# EAGLE design darwin-bp4 (EAGLE 9.6.1)
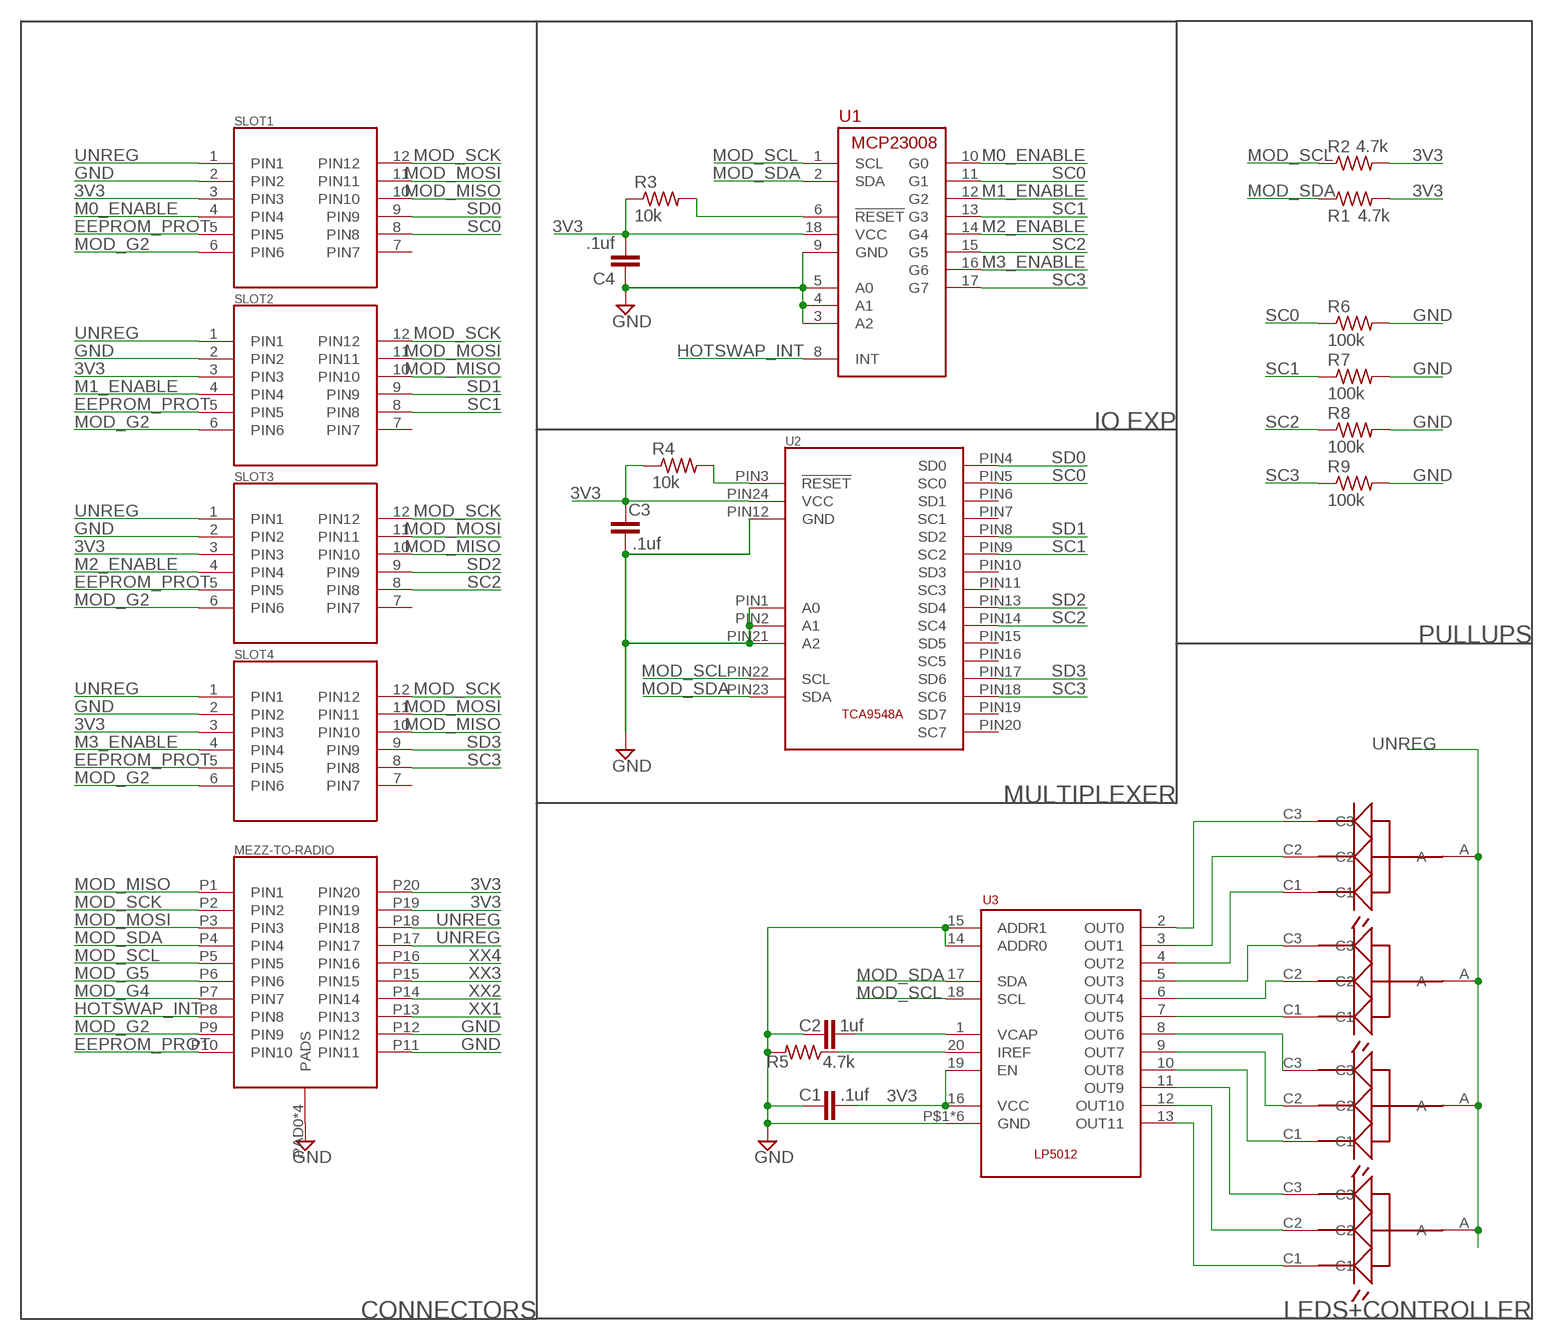
[diagram p0: schematic, sheet 1]

## Parts
C1  .1uf  C-EUC0603K  [C0603K]
C2  1uf  C-EUC0603K  [C0603K]
C3  .1uf  C-EUC0603K  [C0603K]
C4  .1uf  C-EUC0603K  [C0603K]
MEZZ-TO-RADIO  M55-6102042R7102(M)  [M55-7102042R]
R1  4.7k  R-US_R0603  [R0603]
R2  4.7k  R-US_R0603  [R0603]
R3  10k  R-US_R0603  [R0603]
R4  10k  R-US_R0603  [R0603]
R5  4.7k  R-US_R0603  [R0603]
R6  100k  R-US_R0603  [R0603]
R7  100k  R-US_R0603  [R0603]
R8  100k  R-US_R0603  [R0603]
R9  100k  R-US_R0603  [R0603]
SLOT1  2X6-HEADERSDS  [12PH]
SLOT2  2X6-HEADERSDS  [12PH]
SLOT3  2X6-HEADERSDS  [12PH]
SLOT4  2X6-HEADERSDS  [12PH]
U1  MCP23008  [SOIC18-W]
U2  TCA9548A  [TSSOP-24]
U3  LP5012  [QFN40P300X300X80-20N]
U$1  CLMVC-FKC-CGJJM569ABB7A343  [2MMPLCC4]
U$2  CLMVC-FKC-CGJJM569ABB7A343  [2MMPLCC4]
U$3  CLMVC-FKC-CGJJM569ABB7A343  [2MMPLCC4]
U$4  CLMVC-FKC-CGJJM569ABB7A343  [2MMPLCC4]

## Nets
3V3: C1.2 C3.2 C4.2 MEZZ-TO-RADIO.P19(PIN19) MEZZ-TO-RADIO.P20(PIN20) R1.2 R2.2 R3.1 R4.1 SLOT1.3(PIN3) SLOT2.3(PIN3) SLOT3.3(PIN3) SLOT4.3(PIN3) U1.18(VCC) U2.PIN24(VCC) U3.16(VCC) U3.19(EN)
!RESET: R3.2 U1.6(!RESET)
EEPROM_PROT: MEZZ-TO-RADIO.P10(PIN10) SLOT1.5(PIN5) SLOT2.5(PIN5) SLOT3.5(PIN5) SLOT4.5(PIN5)
GND: C1.1 C2.1 C3.1 C4.1 MEZZ-TO-RADIO.P11(PIN11) MEZZ-TO-RADIO.P12(PIN12) MEZZ-TO-RADIO.PAD0(PADS) MEZZ-TO-RADIO.PAD1(PADS) MEZZ-TO-RADIO.PAD2(PADS) MEZZ-TO-RADIO.PAD3(PADS) R5.2 R6.2 R7.2 R8.2 R9.2 SLOT1.2(PIN2) SLOT2.2(PIN2) SLOT3.2(PIN2) SLOT4.2(PIN2) U1.3(A2) U1.4(A1) U1.5(A0) U1.9(GND) U2.PIN1(A0) U2.PIN2(A1) U2.PIN12(GND) U2.PIN21(A2) U3.14(ADDR0) U3.15(ADDR1) U3.P$1(GND) U3.P$2(GND) U3.P$3(GND) U3.P$4(GND) U3.P$5(GND) U3.P$6(GND)
HOTSWAP_INT: MEZZ-TO-RADIO.P8(PIN8) U1.8(INT)
M0_ENABLE: SLOT1.4(PIN4) U1.10(G0)
M1_ENABLE: SLOT2.4(PIN4) U1.12(G2)
M2_ENABLE: SLOT3.4(PIN4) U1.14(G4)
M3_ENABLE: SLOT4.4(PIN4) U1.16(G6)
MOD_G2: MEZZ-TO-RADIO.P9(PIN9) SLOT1.6(PIN6) SLOT2.6(PIN6) SLOT3.6(PIN6) SLOT4.6(PIN6)
MOD_G4: MEZZ-TO-RADIO.P7(PIN7)
MOD_G5: MEZZ-TO-RADIO.P6(PIN6)
MOD_MISO: MEZZ-TO-RADIO.P1(PIN1) SLOT1.10(PIN10) SLOT2.10(PIN10) SLOT3.10(PIN10) SLOT4.10(PIN10)
MOD_MOSI: MEZZ-TO-RADIO.P3(PIN3) SLOT1.11(PIN11) SLOT2.11(PIN11) SLOT3.11(PIN11) SLOT4.11(PIN11)
MOD_SCK: MEZZ-TO-RADIO.P2(PIN2) SLOT1.12(PIN12) SLOT2.12(PIN12) SLOT3.12(PIN12) SLOT4.12(PIN12)
MOD_SCL: MEZZ-TO-RADIO.P5(PIN5) R2.1 U1.1(SCL) U2.PIN22(SCL) U3.18(SCL)
MOD_SDA: MEZZ-TO-RADIO.P4(PIN4) R1.1 U1.2(SDA) U2.PIN23(SDA) U3.17(SDA)
N$1: U3.2(OUT0) U$1.C3
N$2: R4.2 U2.PIN3(!RESET)
N$3: U3.3(OUT1) U$1.C2
N$4: U3.4(OUT2) U$1.C1
N$5: U3.5(OUT3) U$2.C3
N$6: U3.6(OUT4) U$2.C2
N$7: U3.7(OUT5) U$2.C1
N$8: U3.8(OUT6) U$3.C3
N$9: U3.9(OUT7) U$3.C2
N$11: U3.10(OUT8) U$3.C1
N$12: U3.11(OUT9) U$4.C3
N$13: U3.12(OUT10) U$4.C2
N$14: U3.13(OUT11) U$4.C1
N$20: C2.2 U3.1(VCAP)
N$21: R5.1 U3.20(IREF)
SC0: R6.1 SLOT1.8(PIN8) U1.11(G1) U2.PIN5(SC0)
SC1: R7.1 SLOT2.8(PIN8) U1.13(G3) U2.PIN9(SC2)
SC2: R8.1 SLOT3.8(PIN8) U1.15(G5) U2.PIN14(SC4)
SC3: R9.1 SLOT4.8(PIN8) U1.17(G7) U2.PIN18(SC6)
SD0: SLOT1.9(PIN9) U2.PIN4(SD0)
SD1: SLOT2.9(PIN9) U2.PIN8(SD2)
SD2: SLOT3.9(PIN9) U2.PIN13(SD4)
SD3: SLOT4.9(PIN9) U2.PIN17(SD6)
UNREG: MEZZ-TO-RADIO.P17(PIN17) MEZZ-TO-RADIO.P18(PIN18) SLOT1.1(PIN1) SLOT2.1(PIN1) SLOT3.1(PIN1) SLOT4.1(PIN1) U$1.A U$2.A U$3.A U$4.A
XX1: MEZZ-TO-RADIO.P13(PIN13)
XX2: MEZZ-TO-RADIO.P14(PIN14)
XX3: MEZZ-TO-RADIO.P15(PIN15)
XX4: MEZZ-TO-RADIO.P16(PIN16)
Unconnected: SLOT1.7(PIN7) SLOT2.7(PIN7) SLOT3.7(PIN7) SLOT4.7(PIN7) U2.PIN6(SD1) U2.PIN7(SC1) U2.PIN10(SD3) U2.PIN11(SC3) U2.PIN15(SD5) U2.PIN16(SC5) U2.PIN19(SD7) U2.PIN20(SC7)

## Notes on the sheet
- IO EXP
- PULLUPS
- MULTIPLEXER
- CONNECTORS | LEDS+CONTROLLER

## Library data of the parts
C1-C4 = rcl:C-EU: CAPACITOR, European symbol; SPICEPREFIX: C
MEZZ-TO-RADIO = Conservify:M55-6102042R
R1-R9 = rcl:R-US_: RESISTOR, American symbol; SPICEPREFIX: R
SLOT1-SLOT4 = Conservify:2X6-HEADERS
U1 = Conservify:MCP23008
U2 = Conservify:TCA9548A
U3 = Conservify:LP5012
U$1-U$4 = Conservify:CLMVC-FKC-CGJJM569ABB7A343

## Board
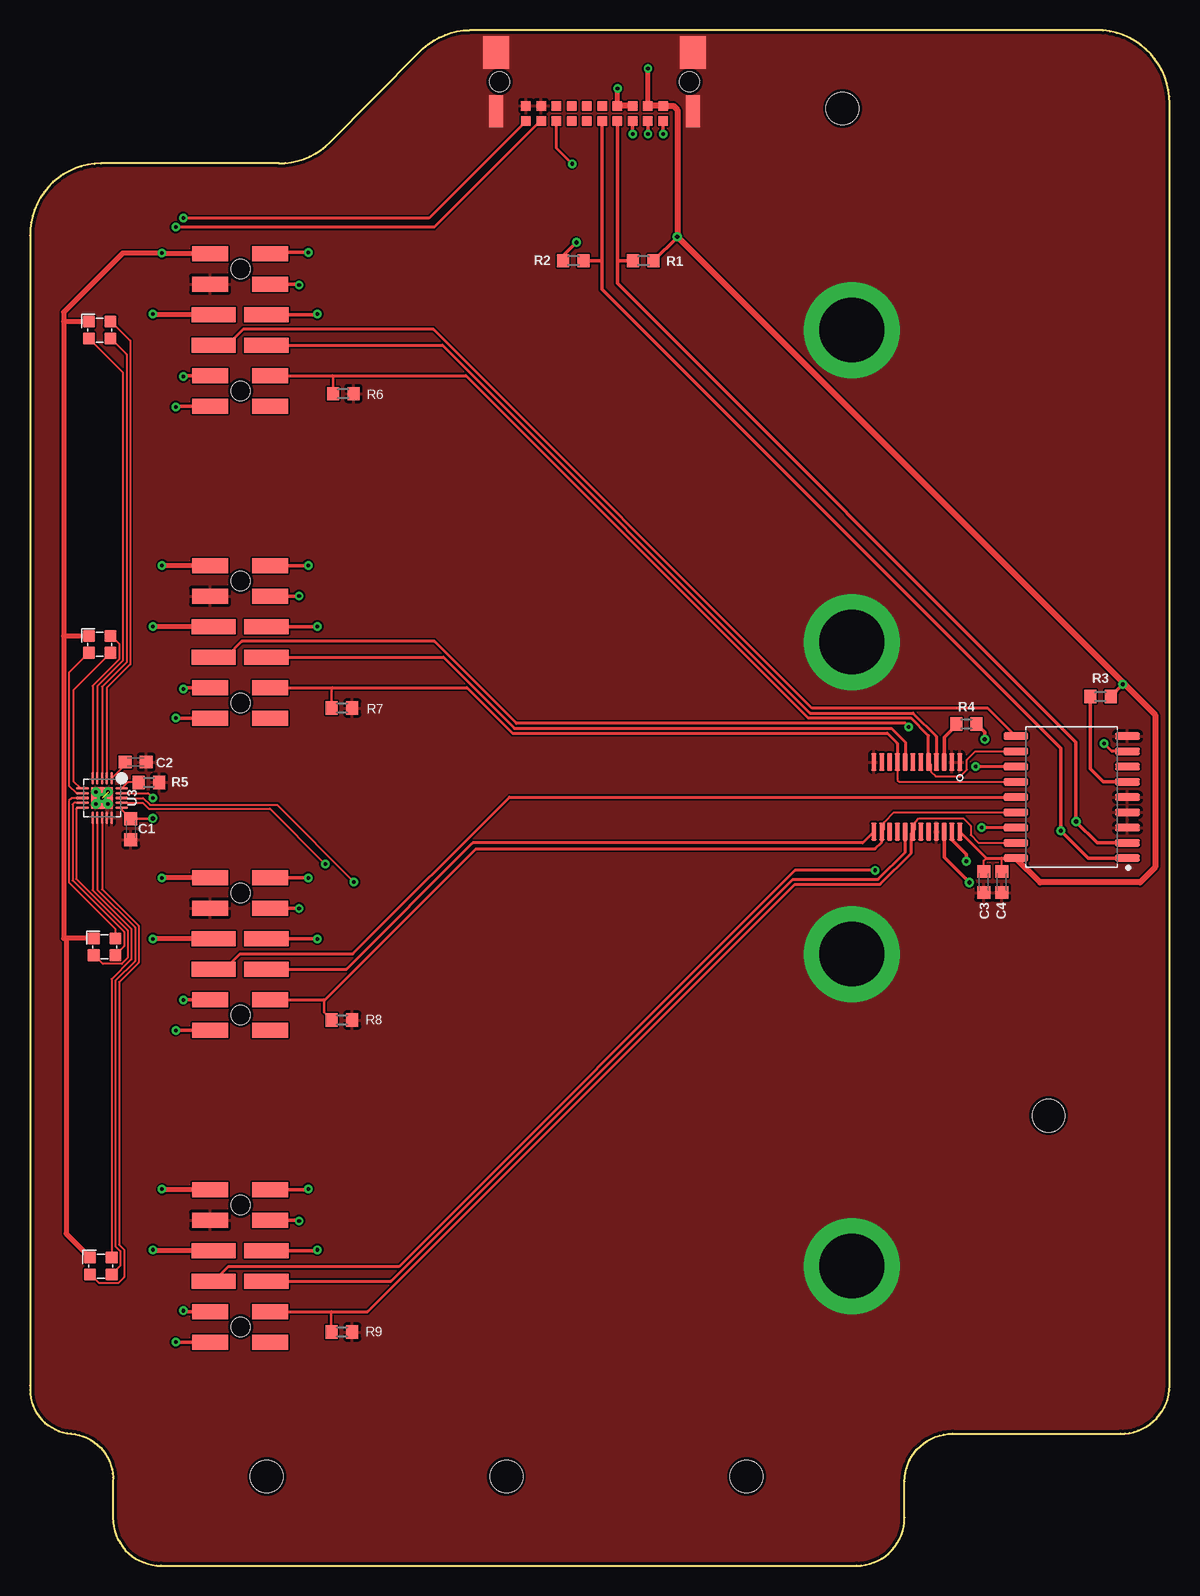
[diagram p1: board, top side]
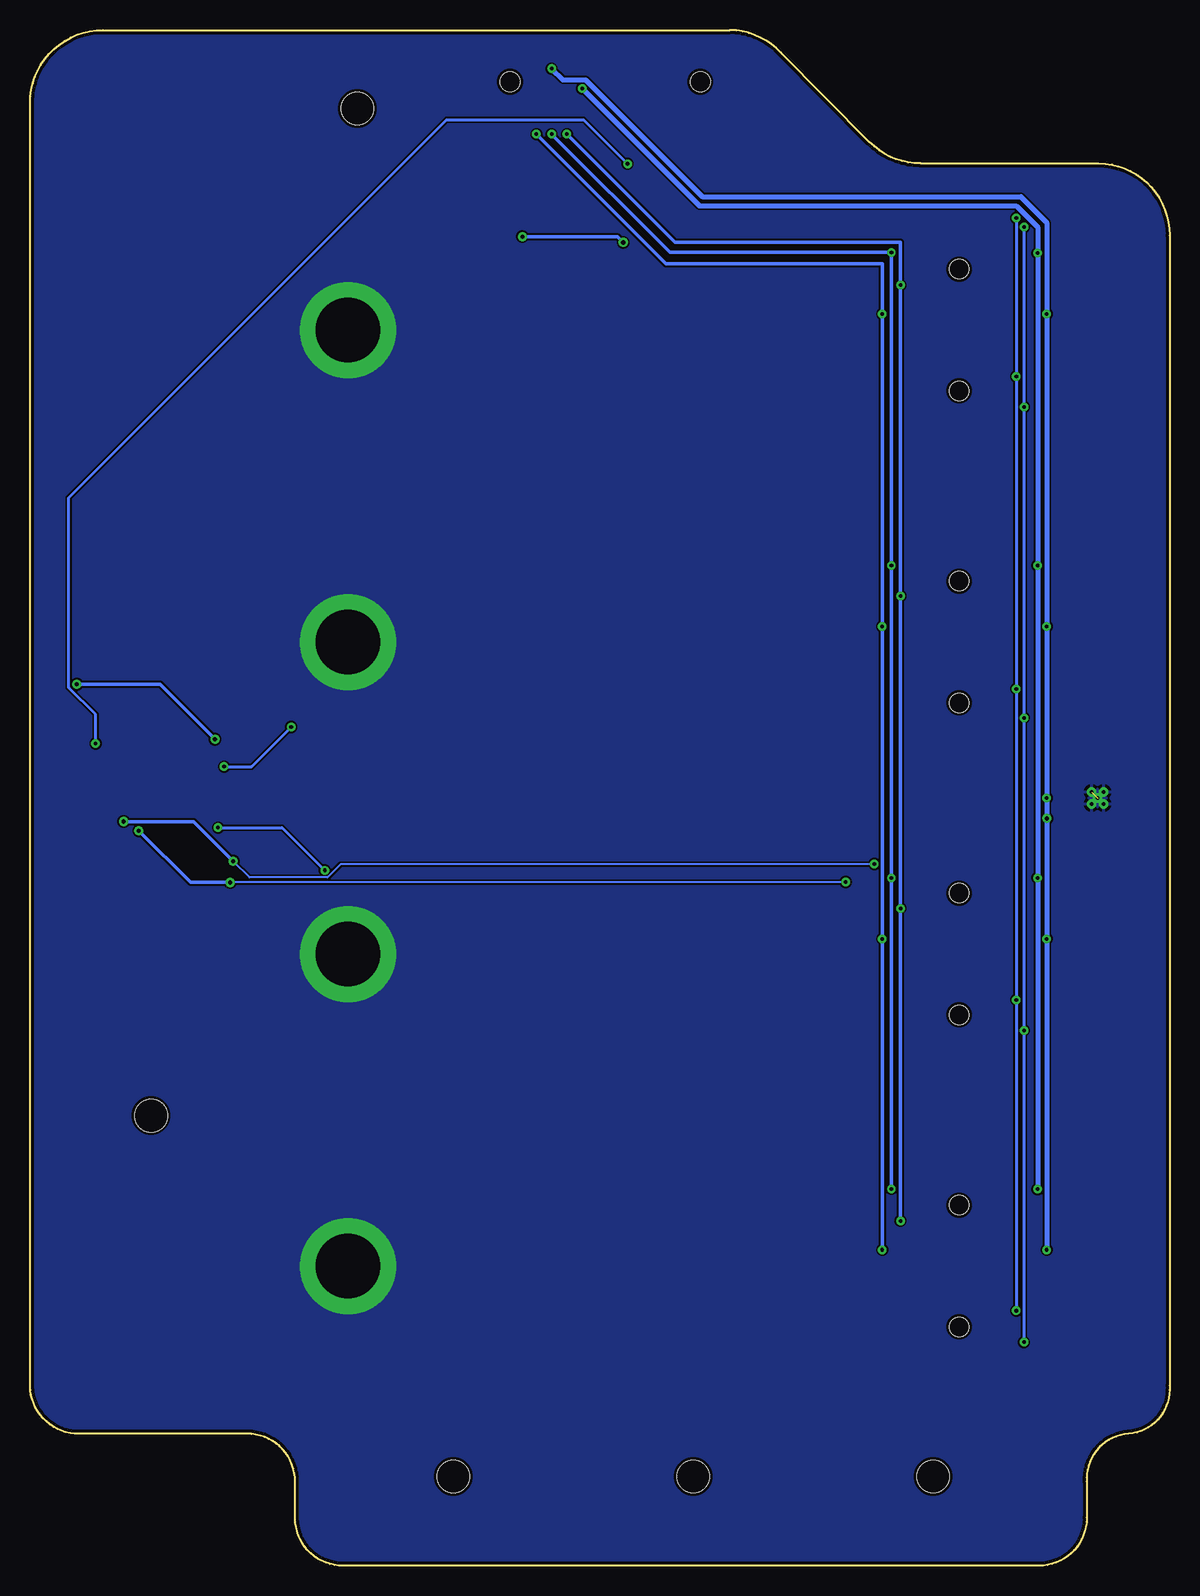
[diagram p2: board, bottom side, seen from below]

Size 95.01 x 127.98 mm. Coordinates in mm from the lower left corner, seen from the top.
Outline: 20.76,116.86 5.91,116.86 arc90 0.01,110.86 0.01,15 arc90 3.41,11 arc-90 6.91,7 6.91,4 arc90 10.91,0 68.91,0 arc90 72.91,4 72.91,7 arc-90 76.91,11 90.91,11 arc90 95.01,15 95.01,121.86 arc90 88.91,127.98 36.66,127.98 arc45 32.4,126.08 25.02,118.64 arc-45 20.76,116.86
Copper layers (1+2*15+16): Top 0.035mm / dielectric 1.5mm / PWR 0.035mm / dielectric 0.15mm / GND 0.035mm / dielectric 0.2mm / Bottom 0.035mm
Design rules "default *": minimum track width 6mil, minimum drill 0.3mm, track to track 6mil, track to pad 6mil, pad to pad 6mil, via to via 6mil, smd to smd 6mil, copper to edge 10mil, drill to drill 6mil, minimum pad ring 10mil, minimum via ring 8mil, stop-mask expansion 4mil, vias tented up to drill 0.31mm, thermal gap 10mil
Holes 2.7 mm at 19.73,7.45 39.73,7.45 59.73,7.45 84.91,37.5 67.73,121.45

### Footprints (pad centres in the part's own frame; a part is rotated, then mirrored left to right if it is on the bottom)
C0603K = smd 1.05 x 1.08: 1 -0.875,0; 2 0.875,0
M55-7102042R = smd 0.8 x 0.8: P1 -5.715,3.27; P2 -4.445,3.27; P3 -3.175,3.27; P4 -1.905,3.27; P5 -0.635,3.27; P6 0.635,3.27; P7 1.905,3.27; P8 3.175,3.27; P9 4.445,3.27; P10 5.715,3.27; P11 5.715,2; P12 4.445,2; P13 3.175,2; P14 1.905,2; P15 0.635,2; P16 -0.635,2; P17 -1.905,2; P18 -3.175,2; P19 -4.445,2; P20 -5.715,2 | smd 2.2 x 2.7: PAD0 -8.21,-2.45; PAD1 8.21,-2.45 | smd 1.2 x 2.7: PAD2 8.21,2.45; PAD3 -8.21,2.45 | hole 1.65: -7.925,0; 7.925,0
R0603 = smd 1 x 1.1: 1 -0.85,0; 2 0.85,0
12PH = smd 3 x 1.27: 1 -2.5,6.35; 2 -2.5,3.81; 5 -2.5,-3.81; 6 -2.5,-6.35; 7 2.5,-6.35; 8 2.5,-3.81; 11 2.5,3.81; 12 2.5,6.35 | smd 3.68 x 1.27: 3 -2.2,1.27; 4 -2.2,-1.27; 9 2.2,-1.27; 10 2.2,1.27 | hole 1.58: 0.041,5.08; 0.041,-5.08
SOIC18-W = smd 2.052 x 0.602: 1 -4.654,5.08; 2 -4.654,3.81; 3 -4.654,2.54; 4 -4.654,1.27; 5 -4.654,0; 6 -4.654,-1.27; 7 -4.654,-2.54; 8 -4.654,-3.81; 9 -4.654,-5.08; 10 4.654,-5.08; 11 4.654,-3.81; 12 4.654,-2.54; 13 4.654,-1.27; 14 4.654,0; 15 4.654,1.27; 16 4.654,2.54; 17 4.654,3.81; 18 4.654,5.08
TSSOP-24 = smd 1.5 x 0.45: PIN1 -3,3; PIN2 -3,2.35; PIN3 -3,1.7; PIN4 -3,1.05; PIN5 -3,0.4; PIN6 -3,-0.25; PIN7 -3,-0.9; PIN8 -3,-1.55; PIN9 -3,-2.2; PIN10 -3,-2.85; PIN11 -3,-3.5; PIN12 -3,-4.15; PIN13 2.8,-4.15; PIN14 2.8,-3.5; PIN15 2.8,-2.85; PIN16 2.8,-2.2; PIN17 2.8,-1.55; PIN18 2.8,-0.9; PIN19 2.8,-0.25; PIN20 2.8,0.4; PIN21 2.8,1.05; PIN22 2.8,1.7; PIN23 2.8,2.35; PIN24 2.8,3
QFN40P300X300X80-20N = smd 1.06 x 0.22: 1 -1.635,0.8; 2 -1.635,0.4; 3 -1.635,0; 4 -1.635,-0.4; 5 -1.635,-0.8; 11 1.635,-0.8; 12 1.635,-0.4; 13 1.635,0; 14 1.635,0.4; 15 1.635,0.8 | smd 0.22 x 1.06: 6 -0.8,-1.635; 7 -0.4,-1.635; 8 0,-1.635; 9 0.4,-1.635; 10 0.8,-1.635; 16 0.8,1.635; 17 0.4,1.635; 18 0,1.635; 19 -0.4,1.635; 20 -0.8,1.635 | smd 1.8 x 1.8: P$1 0,0 | drill 0.3 pad 0.31: P$2 -0.5,0.5; P$3 0.5,0.5; P$4 0.5,-0.5; P$5 -0.5,-0.5; P$6 0,0
2MMPLCC4 = smd 1 x 1: A 0.9,-0.7; C1 0.9,0.7; C2 -0.9,0.7; C3 -0.9,-0.7

### Placement (x,y rotation side)
C1  8.41,61.38 90 top
C2  8.81,66.98 180 top
C3  79.51,56.98 90 top
C4  81.01,56.98 90 top
MEZZ-TO-RADIO  47.06,123.66 180 top
R1  51.14,108.75 0 top
R2  45.3,108.75 180 top
R3  89.24,72.43 180 top
R4  78.06,70.15 180 top
R5  9.91,65.28 0 top
R6  26.11,97.68 0 top
R7  26.01,71.48 0 top
R8  26.01,45.48 0 top
R9  26.01,19.48 0 top
SLOT1  17.51,102.98 0 top
SLOT2  17.51,76.98 0 top
SLOT3  17.51,50.98 0 top
SLOT4  17.51,24.98 0 top
U1  86.84,64.05 180 top
U2  74.51,63.98 270 top
U3  6.01,63.98 270 top
U$1  5.81,102.98 180 top
U$2  5.81,76.78 180 top
U$3  6.21,51.58 180 top
U$4  5.91,24.98 180 top

### Tracks (layer width: path | path; a pad name or v marks a point on that pad's centre or on a via)
3V3  (via drill 0.3, 0.35)
  Top 0.152: U3.16 7.65,63.02 C1.2 | U3.19 9.85,64.38 v10.25,63.98 | C3.2 79.51,58.76 79.72,58.97 | C4.2 81.01,58.97 | 10.22,62.25 v10.25,62.28
  Top 0.203: C1.2 10.22,62.25
  Top 0.254: U2.PIN24 79.72,58.97 81.01,58.97 U1.18
  Top 0.305: R3.1 v91.11,73.45 91.27,73.45 | R4.1 79.59,69.47 v79.59,68.88 | R1.2 53.96,110.72 v53.96,110.76 | R2.2 44.45,109.17 v45.55,110.28
  Top 0.406: MEZZ-TO-RADIO.P19 51.51,124.74 v51.52,124.76 | SLOT1.3 10.31,104.25 v10.25,104.31 | SLOT2.3 10.27,78.25 v10.25,78.27 | SLOT3.3 10.25,52.25 v10.25,52.24 | SLOT4.3 10.33,26.25 v10.25,26.33
  Top 0.508: U1.18 84.22,56.94 92.54,56.94 93.81,58.21 93.81,70.91 91.27,73.45 v53.96,110.76 53.96,121.33 53.63,121.66 MEZZ-TO-RADIO.P20 MEZZ-TO-RADIO.P19
  Bottom 0.305: v45.55,110.28 46.03,110.76 v53.96,110.76 | v79.59,68.88 84.16,73.45 v91.11,73.45
  Bottom 0.406: v51.52,124.76 50.58,123.81 48.69,123.81 38.96,114.09 12.4,114.09 10.25,111.93 v10.25,104.31 v10.25,78.27 v10.25,63.98 v10.25,62.28 v10.25,52.24 v10.25,26.33
!RESET
  Top 0.305: U1.6 89.5,65.32 89.49,65.32 88.39,66.42 R3.2
EEPROM_PROT  (via drill 0.3)
  Top 0.254: MEZZ-TO-RADIO.P10 33.27,112.31 v12.79,112.31
  Top 0.305: SLOT1.5 12.85,99.17 v12.79,99.1 | SLOT2.5 12.89,73.17 v12.79,73.07 | SLOT3.5 12.79,47.17 v12.79,47.16 | SLOT4.5 12.87,21.17 v12.79,21.25
  Bottom 0.254: v12.79,112.31 v12.79,99.1 v12.79,73.07 v12.79,47.16 v12.79,21.25
GND  (via drill 5.4 pad 8)  (1 unrouted)
  other vias: 68.51,102.98 68.51,76.98 68.51,50.98 68.51,24.98
  pour Bottom: 0.01,127.98 95.01,127.98 95.01,-0.02 0.01,-0.02
  pour Top: 0.01,127.98 95.01,127.98 95.01,-0.02 0.01,-0.02
HOTSWAP_INT  (via drill 0.3)
  Top 0.254: U1.8 90.2,67.86 v89.54,68.52 | v45.2,116.83 43.89,118.14 MEZZ-TO-RADIO.P8
  Bottom 0.254: v89.54,68.52 89.54,70.96 91.76,73.18 91.76,89.01 60.28,120.49 48.85,120.49 v45.2,116.83
M0_ENABLE
  Top 0.254: U1.10 79.85,71.47 65.19,71.47 33.64,103.02 17.76,103.02 16.44,101.71 SLOT1.4
M1_ENABLE  (via drill 0.3)
  Top 0.254: U1.12 v78.83,66.59 | v73.24,69.89 73.24,69.96 73,70.2 40.55,70.2 33.73,77.02 17.66,77.02 16.34,75.71 SLOT2.4
  Bottom 0.254: v78.83,66.59 76.54,66.59 v73.24,69.89
M2_ENABLE
  Top 0.254: SLOT3.4 16.22,49.71 17.51,51 26.91,51 39.97,64.05 U1.14
M3_ENABLE  (via drill 0.3)
  Top 0.254: U1.16 v79.34,61.51 v79.33,61.51 | v70.44,57.95 63.77,57.95 30.75,24.93 16.54,24.93 SLOT4.4
  Bottom 0.254: v79.33,61.51 74,61.51 v70.44,57.95
MOD_G2  (via drill 0.3)
  Top 0.254: MEZZ-TO-RADIO.P9 42.54,120.39 33.7,111.55 v12.15,111.55
  Top 0.305: SLOT1.6 12.22,96.63 v12.15,96.56 | SLOT2.6 12.18,70.63 v12.15,70.65 | SLOT3.6 v12.16,44.63 v12.15,44.62 | SLOT4.6 v12.16,18.63 v12.15,18.64
  Bottom 0.254: v12.15,111.55 v12.15,96.56 v12.15,70.65 v12.15,44.62 v12.15,18.64
MOD_MISO  (via drill 0.3)
  Top 0.305: MEZZ-TO-RADIO.P1 52.78,119.31 v52.79,119.29 | SLOT1.10 23.9,104.25 v23.96,104.31 | SLOT2.10 23.94,78.25 v23.96,78.27 | SLOT3.10 v23.95,52.25 v23.96,52.24 | SLOT4.10 23.88,26.25 v23.96,26.33
  Bottom 0.305: v52.79,119.29 42,108.5 23.96,108.5 v23.96,104.31 v23.96,78.27 v23.96,52.24 v23.96,26.33
MOD_MOSI  (via drill 0.3)
  Top 0.305: MEZZ-TO-RADIO.P3 50.24,119.31 v50.25,119.29 | SLOT1.11 22.37,106.79 v22.44,106.72 | SLOT2.11 22.41,80.79 v22.44,80.81 | SLOT3.11 22.43,54.79 v22.44,54.78 | SLOT4.11 22.39,28.79 v22.44,28.74
  Bottom 0.305: v50.25,119.29 41.23,110.28 22.44,110.28 v22.44,106.72 v22.44,80.81 v22.44,54.78 v22.44,28.74
MOD_SCK  (via drill 0.3)
  Top 0.305: MEZZ-TO-RADIO.P2 51.51,119.31 v51.52,119.29 | SLOT1.12 20.12,109.44 v23.2,109.44 | SLOT2.12 23.17,83.33 v23.2,83.35 | SLOT3.12 23.19,57.33 v23.2,57.32 | SLOT4.12 23.12,31.33 v23.2,31.41
  Bottom 0.305: v51.52,119.29 41.67,109.44 v23.2,109.44 v23.2,83.35 v23.2,57.32 v23.2,31.41
MOD_SCL  (via drill 0.3, 0.35)
  Top 0.152: U3.18 9.42,63.98 10,63.4 20.59,63.4 v27.01,56.98
  Top 0.305: MEZZ-TO-RADIO.P5 47.7,108.75 | 47.7,108.75 47.7,106.36 85.94,68.11 v85.94,61.26 88.22,58.97 U1.1 | U2.PIN22 76.21,59.04 v78.32,56.94 | R2.1 47.7,108.75
  Bottom 0.152: v27.01,56.98 78.28,56.98 v78.32,56.94
  Bottom 0.305: v78.32,56.94 81.62,56.94 v85.94,61.26
MOD_SDA  (via drill 0.3, 0.35)
  Top 0.152: U3.17 9.39,63.58 9.88,63.09 20.01,63.09 v24.62,58.48
  Top 0.305: MEZZ-TO-RADIO.P4 48.97,108.75 | 48.97,108.75 48.97,106.86 87.21,68.62 v87.21,62.02 88.98,60.24 U1.2 | v78.06,58.72 78.06,59.27 76.88,60.45 76.88,61.16 U2.PIN23 | R1.1 48.97,108.75
  Bottom 0.152: v24.62,58.48 69.1,58.48 70.2,57.37 76.72,57.37 v78.06,58.72
  Bottom 0.305: v78.06,58.72 81.37,62.02 v87.21,62.02
N$1
  Top 0.152: U$1.C3 6.78,103.68 8.35,102.1 8.35,75.12 6.41,73.18 U3.2
N$2
  Top 0.305: R4.2 77.21,70.06 76.21,69.06 U2.PIN3
N$3
  Top 0.152: U$1.C2 8.05,100.94 8.05,75.29 6.01,73.25 U3.3
N$4
  Top 0.152: U$1.C1 7.74,99.44 7.74,75.42 5.61,73.28 U3.4
N$5
  Top 0.152: U$2.C3 6.78,77.48 7.44,76.81 7.44,75.54 5.21,73.31 U3.5
N$6
  Top 0.152: U$2.C2 3.61,72.98 3.61,65.38 4.21,64.78 U3.6
N$7
  Top 0.152: U$2.C1 3.24,74.41 3.24,65.01 3.88,64.38 U3.7
N$8
  Top 0.152: U3.8 3.48,63.98 3.24,63.74 3.24,56.95 7.11,53.08 U$3.C3
N$9
  Top 0.152: U3.9 3.68,63.58 3.55,63.45 3.55,57.11 7.84,52.81 7.84,51.64 7.11,50.91 U$3.C2
N$11
  Top 0.152: U3.10 3.98,63.18 3.85,63.05 3.85,57.23 8.14,52.94 8.14,50.65 7.65,50.15 6.08,50.15 5.35,50.88 U$3.C1
N$12
  Top 0.152: U3.11 5.21,56.3 8.45,53.07 8.45,50.52 6.81,48.88 U$4.C3
N$13
  Top 0.152: U3.12 5.61,56.34 8.75,53.19 8.75,50.39 7.12,48.76 7.12,26.64 7.54,26.21 7.54,25.01 U$4.C2
N$14
  Top 0.152: U3.13 6.01,56.37 9.06,53.32 9.06,50.27 7.42,48.63 7.42,26.76 7.84,26.34 7.84,24.05 7.35,23.55 5.78,23.55 5.05,24.28 U$4.C1
N$20
  Top 0.152: U3.1 7.94,66.74 C2.2
N$21
  Top 0.152: R5.1 8.15,65.28 U3.20
SC0
  Top 0.152: U2.PIN5 75.11,66.78 75.11,66.19 75.52,65.78 77.56,65.78 78.11,66.33 78.11,67.15 78.83,67.86 U1.11
  Top 0.2: R6.1 25.26,99.12 25.21,99.17
  Top 0.254: SLOT1.8 25.21,99.17 36.34,99.17 64.86,70.65 73.44,70.65 74.91,69.18 U2.PIN5
SC1
  Top 0.152: U2.PIN9 72.32,66.97 72.32,65.47 72.47,65.32 U1.13
  Top 0.2: R7.1 25.16,73.12 25.21,73.17
  Top 0.254: SLOT2.8 25.21,73.17 36.43,73.17 40.22,69.38 71.46,69.38 72.31,68.53 U2.PIN9
SC2
  Top 0.152: U2.PIN14 71.21,61.37 71.21,61.97 72.02,62.78 U1.15
  Top 0.2: R8.1 24.51,46.13 24.51,47.17
  Top 0.254: SLOT3.8 24.51,47.17 24.61,47.17 37.17,59.73 70.44,59.73 71.01,60.3 U2.PIN14
SC3
  Top 0.152: U2.PIN18 73.81,61.37 73.81,61.97 74.11,62.27 77.81,62.27 78.42,61.66 78.42,60.9 79.08,60.24 U1.17
  Top 0.2: R9.1 25.11,19.53 25.11,21.17
  Top 0.254: SLOT4.8 25.11,21.17 28.14,21.17 63.75,56.79 70.87,56.79 73.47,59.39 73.47,61.03 U2.PIN18
SD0
  Top 0.254: SLOT1.9 34.38,101.71 65.02,71.06 73.61,71.06 75.56,69.11 U2.PIN4
SD1
  Top 0.254: SLOT2.9 34.47,75.71 40.39,69.79 71.82,69.79 72.96,68.64 U2.PIN8
SD2
  Top 0.254: SLOT3.9 26.38,49.71 36.92,60.24 69.42,60.24 U2.PIN13
SD3
  Top 0.254: SLOT4.9 30.1,23.71 63.59,57.19 70.7,57.19 72.96,59.46 U2.PIN17
UNREG  (via drill 0.3)
  Top 0.406: MEZZ-TO-RADIO.P17 48.97,123.09 v48.98,123.1 | SLOT1.1 11.06,109.33 v11.01,109.38 7.71,109.38 2.81,104.48 2.81,103.68 | SLOT2.1 11.03,83.33 v11.01,83.35 | SLOT3.1 v11.02,57.33 v11.01,57.32 | SLOT4.1 11.06,31.33 v11.01,31.38 | 2.81,103.68 2.81,77.48 | 2.81,77.48 2.81,52.28 3.01,52.28 | 3.01,52.28 3.01,27.68 U$4.A | U$3.A 3.01,52.28 | U$2.A 2.81,77.48 | U$1.A 2.81,103.68
  Top 0.508: MEZZ-TO-RADIO.P18 MEZZ-TO-RADIO.P17
  Bottom 0.406: v48.98,123.1 39.2,113.33 12.79,113.33 11.01,111.55 v11.01,109.38 v11.01,83.35 v11.01,57.32 v11.01,31.38